# EAGLE design frontend (EAGLE 9.3.1)

## Sheet 1 of 2
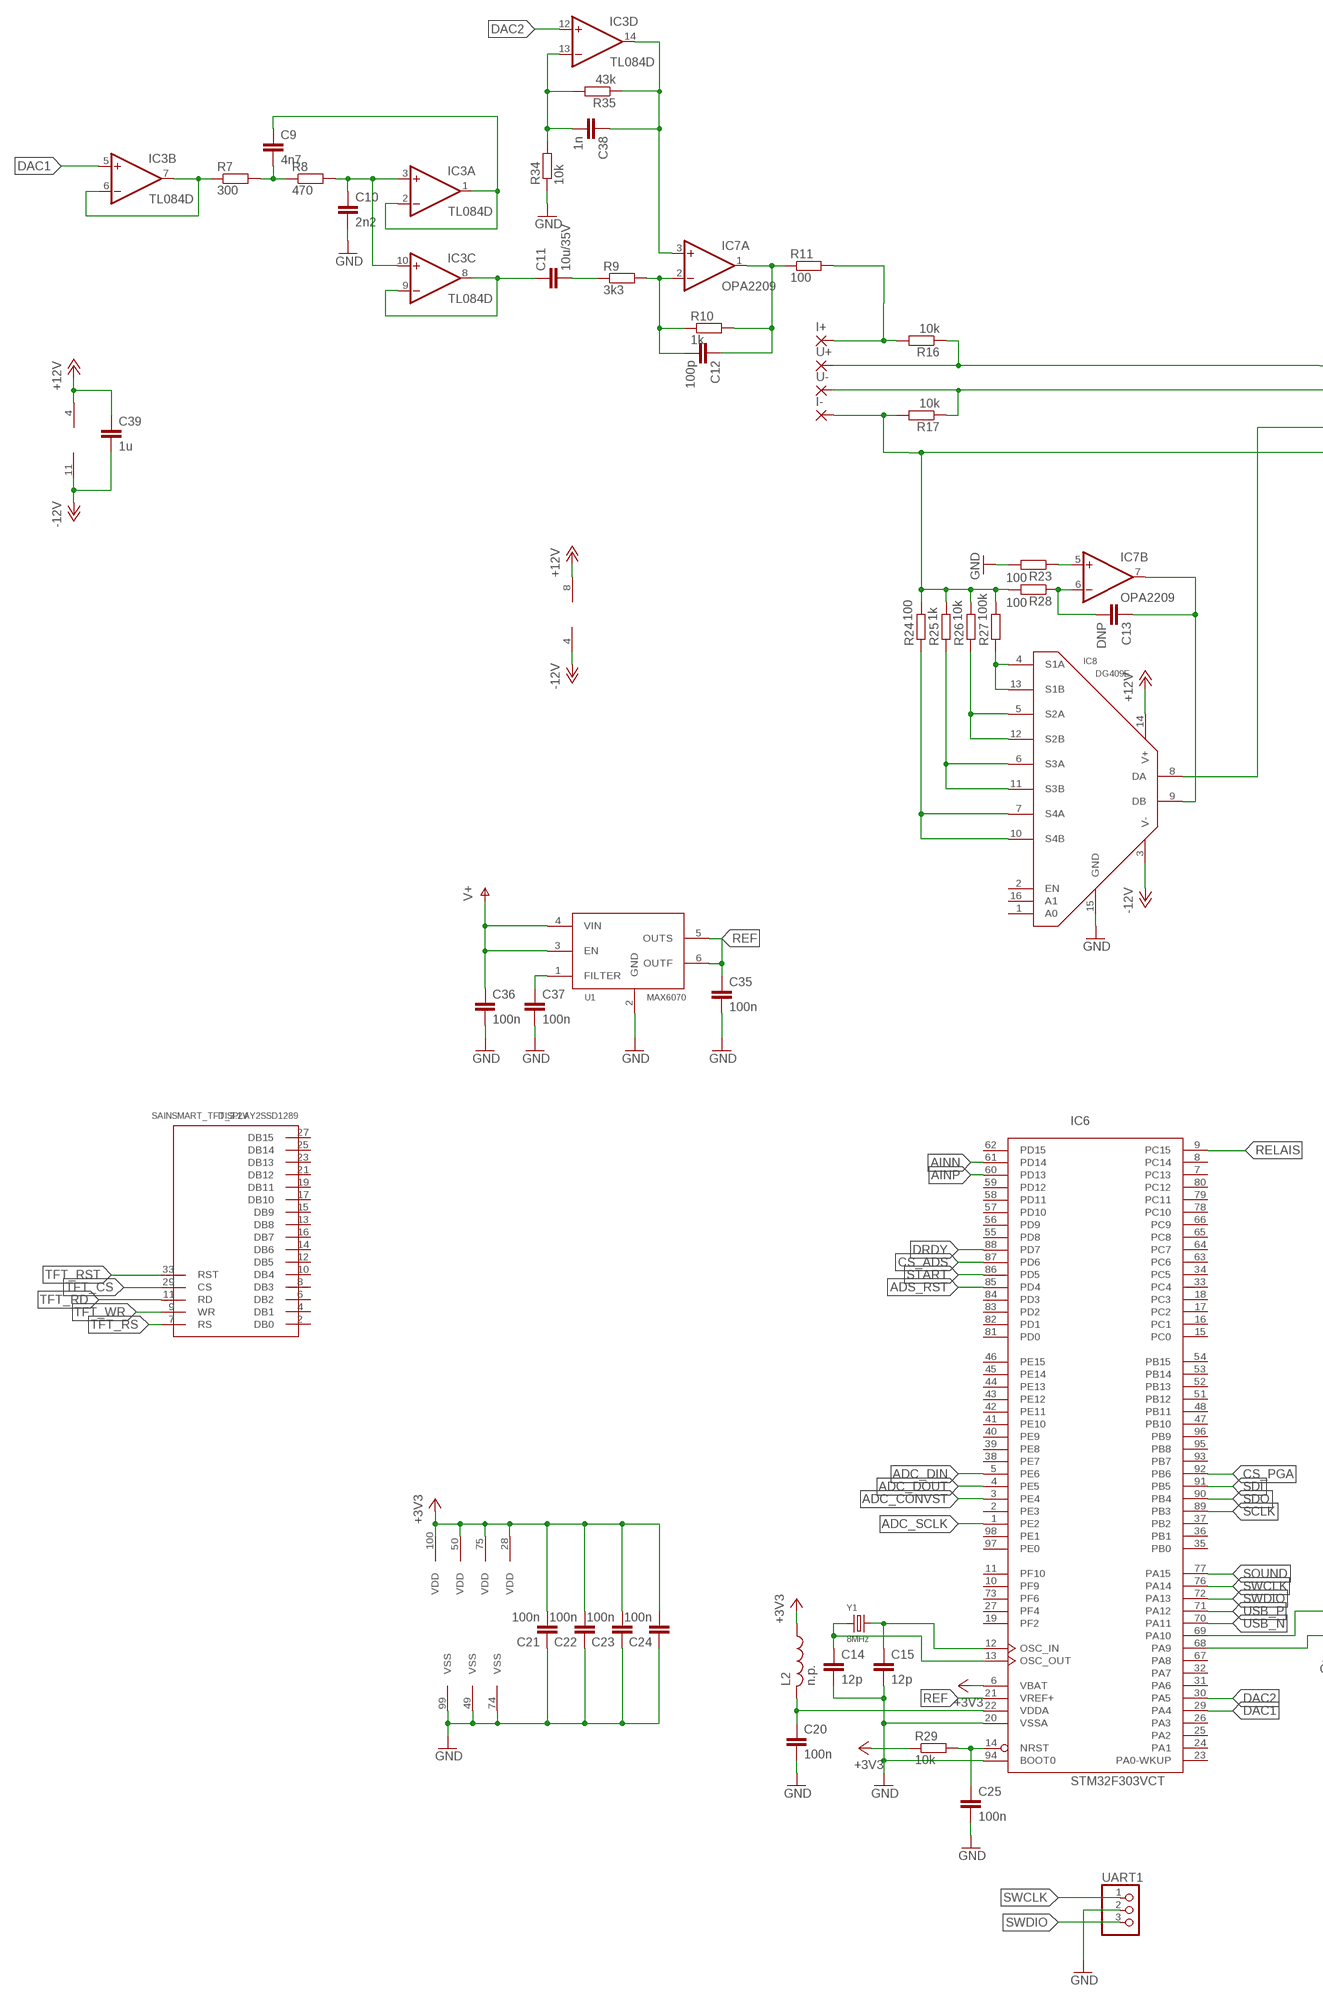
[diagram p0: schematic, sheet 1, part 1 of 2]
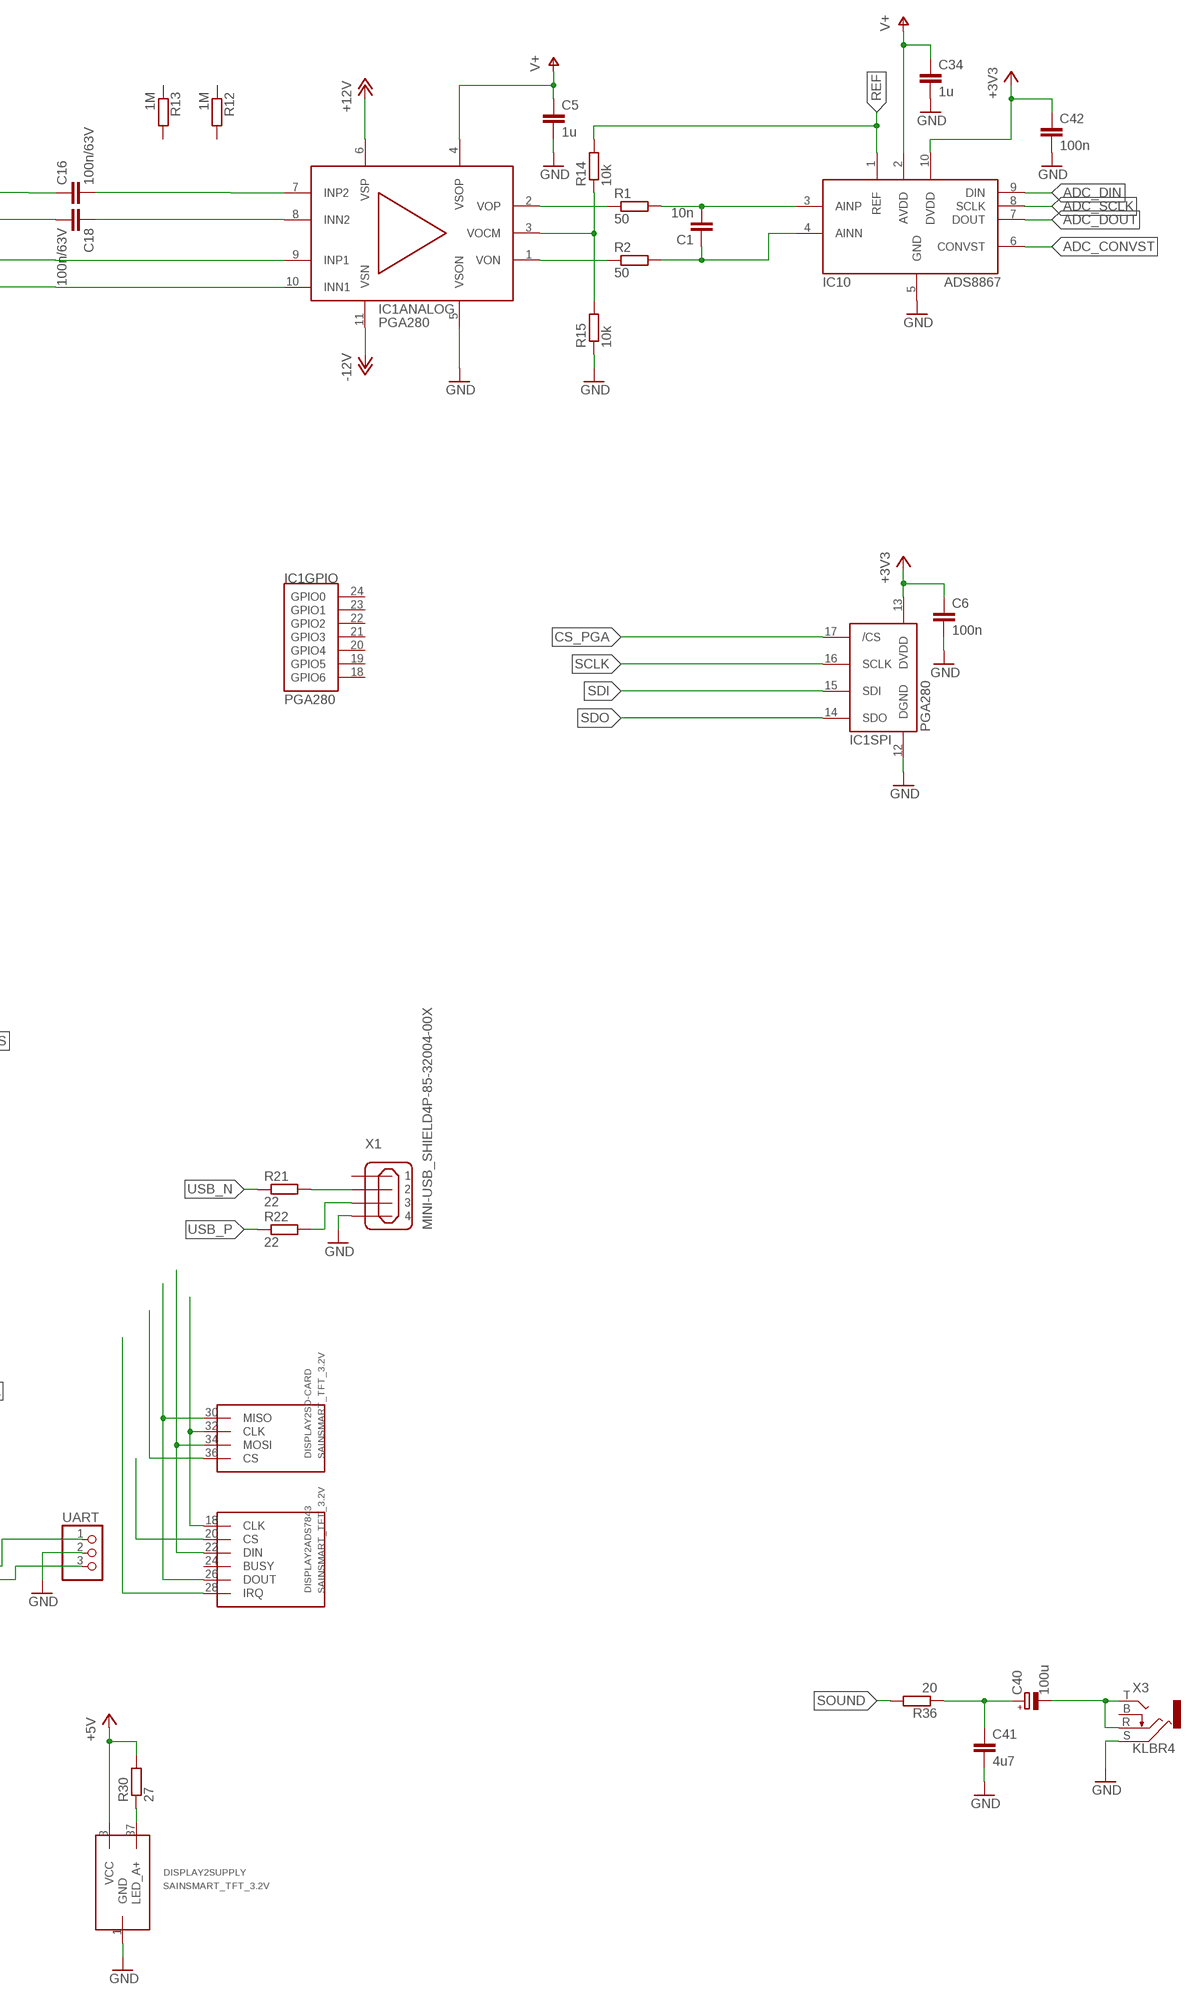
[diagram p1: schematic, sheet 1, part 2 of 2]

### Parts
C1  10n  C-EUC0603K  [C0603K]
C5  1u  C-EUC0603K  [C0603K]
C6  100n  C-EUC0603K  [C0603K]
C9  4n7  C-EUC0603K  [C0603K]
C10  2n2  C-EUC0603K  [C0603K]
C11  10u/35V  C-EUC1206K  [C1206K]
C12  100p  C-EUC0603K  [C0603K]
C13  DNP  C-EUC0603K  [C0603K]
C14  12p  C-EUC0603K  [C0603K]
C15  12p  C-EUC0603K  [C0603K]
C16  100n/63V  C-EUC1206K  [C1206K]
C18  100n/63V  C-EUC1206K  [C1206K]
C20  100n  C-EUC0603K  [C0603K]
C21  100n  C-EUC0603K  [C0603K]
C22  100n  C-EUC0603K  [C0603K]
C23  100n  C-EUC0603K  [C0603K]
C24  100n  C-EUC0603K  [C0603K]
C25  100n  C-EUC0603K  [C0603K]
C34  1u  C-EUC0603K  [C0603K]
C35  100n  C-EUC0603K  [C0603K]
C36  100n  C-EUC0603K  [C0603K]
C37  100n  C-EUC0603K  [C0603K]
C38  1n  C-EUC0603K  [C0603K]
C39  1u  C-EUC0603K  [C0603K]
C40  100u  CPOL-EUE2.5-5  [E2,5-5]
C41  4u7  C-EUC1206K  [C1206K]
C42  100n  C-EUC0603K  [C0603K]
DISPLAY2  SAINSMART_TFT_3.2V  [SAINSMART_ANGLED]
I+  SMD5  [SMD2,54-5,08]
I-  SMD5  [SMD2,54-5,08]
IC1  PGA280  [TSSOP24]
IC3  TL084D  [SO14]
IC6  STM32F303VCT  [LQFP100]
IC7  OPA2209  TL082D  [SO08]
IC8  DG409E  [TSSOP16]
IC10  ADS8867  [SOP50P490X110-10N]
L2  n.p.  INDUCTOR0603  [R0603]
R1  50  R-EU_R0603  [R0603]
R2  50  R-EU_R0603  [R0603]
R7  300  R-EU_R0603  [R0603]
R8  470  R-EU_R0603  [R0603]
R9  3k3  R-EU_R0603  [R0603]
R10  1k  R-EU_R0603  [R0603]
R11  100  R-EU_R0603  [R0603]
R12  1M  R-EU_R0603  [R0603]
R13  1M  R-EU_R0603  [R0603]
R14  10k  R-EU_R0603  [R0603]
R15  10k  R-EU_R0603  [R0603]
R16  10k  R-EU_R0603  [R0603]
R17  10k  R-EU_R0603  [R0603]
R21  22  R-EU_R0603  [R0603]
R22  22  R-EU_R0603  [R0603]
R23  100  R-EU_R0603  [R0603]
R24  100  R-EU_R0603  [R0603]
R25  1k  R-EU_R0603  [R0603]
R26  10k  R-EU_R0603  [R0603]
R27  100k  R-EU_R0603  [R0603]
R28  100  R-EU_R0603  [R0603]
R29  10k  R-EU_R0603  [R0603]
R30  27  R-EU_R1206  [R1206]
R34  10k  R-EU_R0603  [R0603]
R35  43k  R-EU_R0603  [R0603]
R36  20  R-EU_R1206  [R1206]
U1  MAX6070  [SOT23-6L]
U+  SMD5  [SMD2,54-5,08]
U-  SMD5  [SMD2,54-5,08]
UART  PINHD-1X3  [1X03]
UART1  PINHD-1X3  [1X03]
X1  MINI-USB_SHIELD4P-85-32004-00X  [85-32004-00X]
X3  KLBR4  [KLBR4]
Y1  8MHz  CRYSTAL.3.2X2.5MM  [3.2X2.5MM]

### Nets
+3V3: C6.1 C21.2 C22.2 C23.2 C24.2 C42.1 IC1.13(SPI:DVDD) IC6.6(VBAT) IC6.28(VDD) IC6.50(VDD) IC6.75(VDD) IC6.100(VDD) IC10.10(DVDD) L2.1 R29.1 ; also sheet 2
+5V: DISPLAY2.3(SUPPLY:VCC) R30.2 ; also sheet 2
+12V: C39.1 IC1.6(ANALOG:VSP) IC3.4(P:V+) IC7.8(P:V+) IC8.14(V+) ; also sheet 2
-12V: C39.2 IC1.11(ANALOG:VSN) IC3.11(P:V-) IC7.4(P:V-) IC8.3(V-) ; also sheet 2
ADC_CONVST: IC6.3(PE4) IC10.6(CONVST)
ADC_DIN: IC6.5(PE6) IC10.9(DIN)
ADC_DOUT: IC6.4(PE5) IC10.7(DOUT)
ADC_SCLK: IC6.1(PE2) IC10.8(SCLK)
ADS_RST: IC6.85(PD4)
AINN: C1.1 IC6.61(PD14) IC10.4(AINN) R2.2
AINP: C1.2 IC6.60(PD13) IC10.3(AINP) R1.2
CS_ADS: IC6.87(PD6)
CS_PGA: IC1.17(SPI:/CS) IC6.92(PB6)
DAC1: IC3.5(B:+IN) IC6.29(PA4)
DAC2: IC3.12(D:+IN) IC6.30(PA5)
DRDY: IC6.88(PD7)
EXT4: C20.1 IC6.22(VDDA) L2.2
GND: C5.2 C6.2 C10.2 C14.2 C15.2 C20.2 C21.1 C22.1 C23.1 C24.1 C25.2 C34.2 C35.2 C36.2 C37.2 C41.2 C42.2 DISPLAY2.1(SUPPLY:GND) IC1.5(ANALOG:VSON) IC1.12(SPI:DGND) IC6.20(VSSA) IC6.49(VSS) IC6.74(VSS) IC6.94(BOOT0) IC6.99(VSS) IC8.15(GND) IC10.5(GND) R15.1 R23.2 R34.1 U1.2(GND) UART1.2 UART.2 X1.4 X3.S ; also sheet 2
I+: I+.1(P) R11.2 R16.2
I-: I-.1(P) IC1.10(ANALOG:INN1) R17.2 R24.2 R25.2 R26.2 R27.2 R28.2
N$1: IC3.6(B:-IN) IC3.7(B:OUT) R7.1
N$2: C9.2 R7.2 R8.1
N$3: C10.1 IC3.3(A:+IN) IC3.10(C:+IN) R8.2
N$4: C9.1 IC3.1(A:OUT) IC3.2(A:-IN)
N$5: C16.2 IC1.7(ANALOG:INP2)
N$6: C11.1 IC3.8(C:OUT) IC3.9(C:-IN)
N$7: C11.2 R9.1
N$8: C12.2 IC7.2(A:-IN) R9.2 R10.1
N$9: C12.1 IC7.1(A:OUT) R10.2 R11.1
N$10: IC1.3(ANALOG:VOCM) R14.1 R15.2
N$12: C18.1 IC1.8(ANALOG:INN2)
N$14: C38.1 IC3.14(D:OUT) IC7.3(A:+IN) R35.1
N$17: C38.2 IC3.13(D:-IN) R34.2 R35.2
N$18: IC1.9(ANALOG:INP1) IC8.8(DA)
N$21: C13.1 IC7.7(B:OUT) IC8.9(DB)
N$22: C40.+ C41.1 R36.1
N$25: C37.1 U1.1(FILTER)
N$34: C13.2 IC7.6(B:-IN) R28.1
N$36: IC8.4(S1A) IC8.13(S1B) R27.1
N$37: IC8.5(S2A) IC8.12(S2B) R26.1
N$38: IC8.6(S3A) IC8.11(S3B) R25.1
N$39: IC8.7(S4A) IC8.10(S4B) R24.1
N$42: C40.- X3.R X3.T
N$53: C15.1 IC6.12(OSC_IN) Y1.3
N$54: C14.1 IC6.13(OSC_OUT) Y1.1
N$55: R21.2 X1.2
N$56: R22.2 X1.3
N$57: DISPLAY2.22(ADS7843:DIN) DISPLAY2.34(SD-CARD:MOSI)
N$58: DISPLAY2.26(ADS7843:DOUT) DISPLAY2.30(SD-CARD:MISO)
N$59: DISPLAY2.18(ADS7843:CLK) DISPLAY2.32(SD-CARD:CLK)
N$60: C25.1 IC6.14(NRST) R29.2
N$61: DISPLAY2.37(SUPPLY:LED_A+) R30.1
N$66: DISPLAY2.36(SD-CARD:CS)
N$67: DISPLAY2.20(ADS7843:CS)
N$72: DISPLAY2.28(ADS7843:IRQ)
N$81: IC7.5(B:+IN) R23.1
REF: C35.1 IC6.21(VREF+) IC10.1(REF) R14.2 U1.5(OUTS) U1.6(OUTF)
RELAIS: IC6.9(PC15)
RX: IC6.69(PA10) UART.1
SCLK: IC1.16(SPI:SCLK) IC6.89(PB3)
SDI: IC1.15(SPI:SDI) IC6.91(PB5)
SDO: IC1.14(SPI:SDO) IC6.90(PB4)
SOUND: IC6.77(PA15) R36.2
START: IC6.86(PD5)
SWCLK: IC6.76(PA14) UART1.1
SWDIO: IC6.72(PA13) UART1.3
TFT_CS: DISPLAY2.29(SSD1289:CS)
TFT_RD: DISPLAY2.11(SSD1289:RD)
TFT_RS: DISPLAY2.7(SSD1289:RS)
TFT_RST: DISPLAY2.33(SSD1289:RST)
TFT_WR: DISPLAY2.9(SSD1289:WR)
TX: IC6.68(PA9) UART.3
U+: C16.1 R16.1 U+.1(P)
U-: C18.2 R17.1 U-.1(P)
USB_N: IC6.70(PA11) R21.1
USB_P: IC6.71(PA12) R22.1
V+: C5.1 C34.1 C36.1 IC1.4(ANALOG:VSOP) IC10.2(AVDD) U1.3(EN) U1.4(VIN) ; also sheet 2
VON: IC1.1(ANALOG:VON) R2.1
VOP: IC1.2(ANALOG:VOP) R1.1
Unconnected: DISPLAY2.2(SSD1289:DB0) DISPLAY2.4(SSD1289:DB1) DISPLAY2.6(SSD1289:DB2) DISPLAY2.8(SSD1289:DB3) DISPLAY2.10(SSD1289:DB4) DISPLAY2.12(SSD1289:DB5) DISPLAY2.13(SSD1289:DB8) DISPLAY2.14(SSD1289:DB6) DISPLAY2.15(SSD1289:DB9) DISPLAY2.16(SSD1289:DB7) DISPLAY2.17(SSD1289:DB10) DISPLAY2.19(SSD1289:DB11) DISPLAY2.21(SSD1289:DB12) DISPLAY2.23(SSD1289:DB13) DISPLAY2.24(ADS7843:BUSY) DISPLAY2.25(SSD1289:DB14) DISPLAY2.27(SSD1289:DB15) IC1.18(GPIO:GPIO6) IC1.19(GPIO:GPIO5) IC1.20(GPIO:GPIO4) IC1.21(GPIO:GPIO3) IC1.22(GPIO:GPIO2) IC1.23(GPIO:GPIO1) IC1.24(GPIO:GPIO0) IC6.2(PE3) IC6.7(PC13) IC6.8(PC14) IC6.10(PF9) IC6.11(PF10) IC6.15(PC0) IC6.16(PC1) IC6.17(PC2) IC6.18(PC3) IC6.19(PF2) IC6.23(PA0-WKUP) IC6.24(PA1) IC6.25(PA2) IC6.26(PA3) IC6.27(PF4) IC6.31(PA6) IC6.32(PA7) IC6.33(PC4) IC6.34(PC5) IC6.35(PB0) IC6.36(PB1) IC6.37(PB2) IC6.38(PE7) IC6.39(PE8) IC6.40(PE9) IC6.41(PE10) IC6.42(PE11) IC6.43(PE12) IC6.44(PE13) IC6.45(PE14) IC6.46(PE15) IC6.47(PB10) IC6.48(PB11) IC6.51(PB12) IC6.52(PB13) IC6.53(PB14) IC6.54(PB15) IC6.55(PD8) IC6.56(PD9) IC6.57(PD10) IC6.58(PD11) IC6.59(PD12) IC6.62(PD15) IC6.63(PC6) IC6.64(PC7) IC6.65(PC8) IC6.66(PC9) IC6.67(PA8) IC6.73(PF6) IC6.78(PC10) IC6.79(PC11) IC6.80(PC12) IC6.81(PD0) IC6.82(PD1) IC6.83(PD2) IC6.84(PD3) IC6.93(PB7) IC6.95(PB8) IC6.96(PB9) IC6.97(PE0) IC6.98(PE1) IC8.1(A0) IC8.2(EN) IC8.16(A1) R12.1 R12.2 R13.1 R13.2 X1.1 X1.M1(S1) X1.M2(S2) X3.B

## Sheet 2 of 2
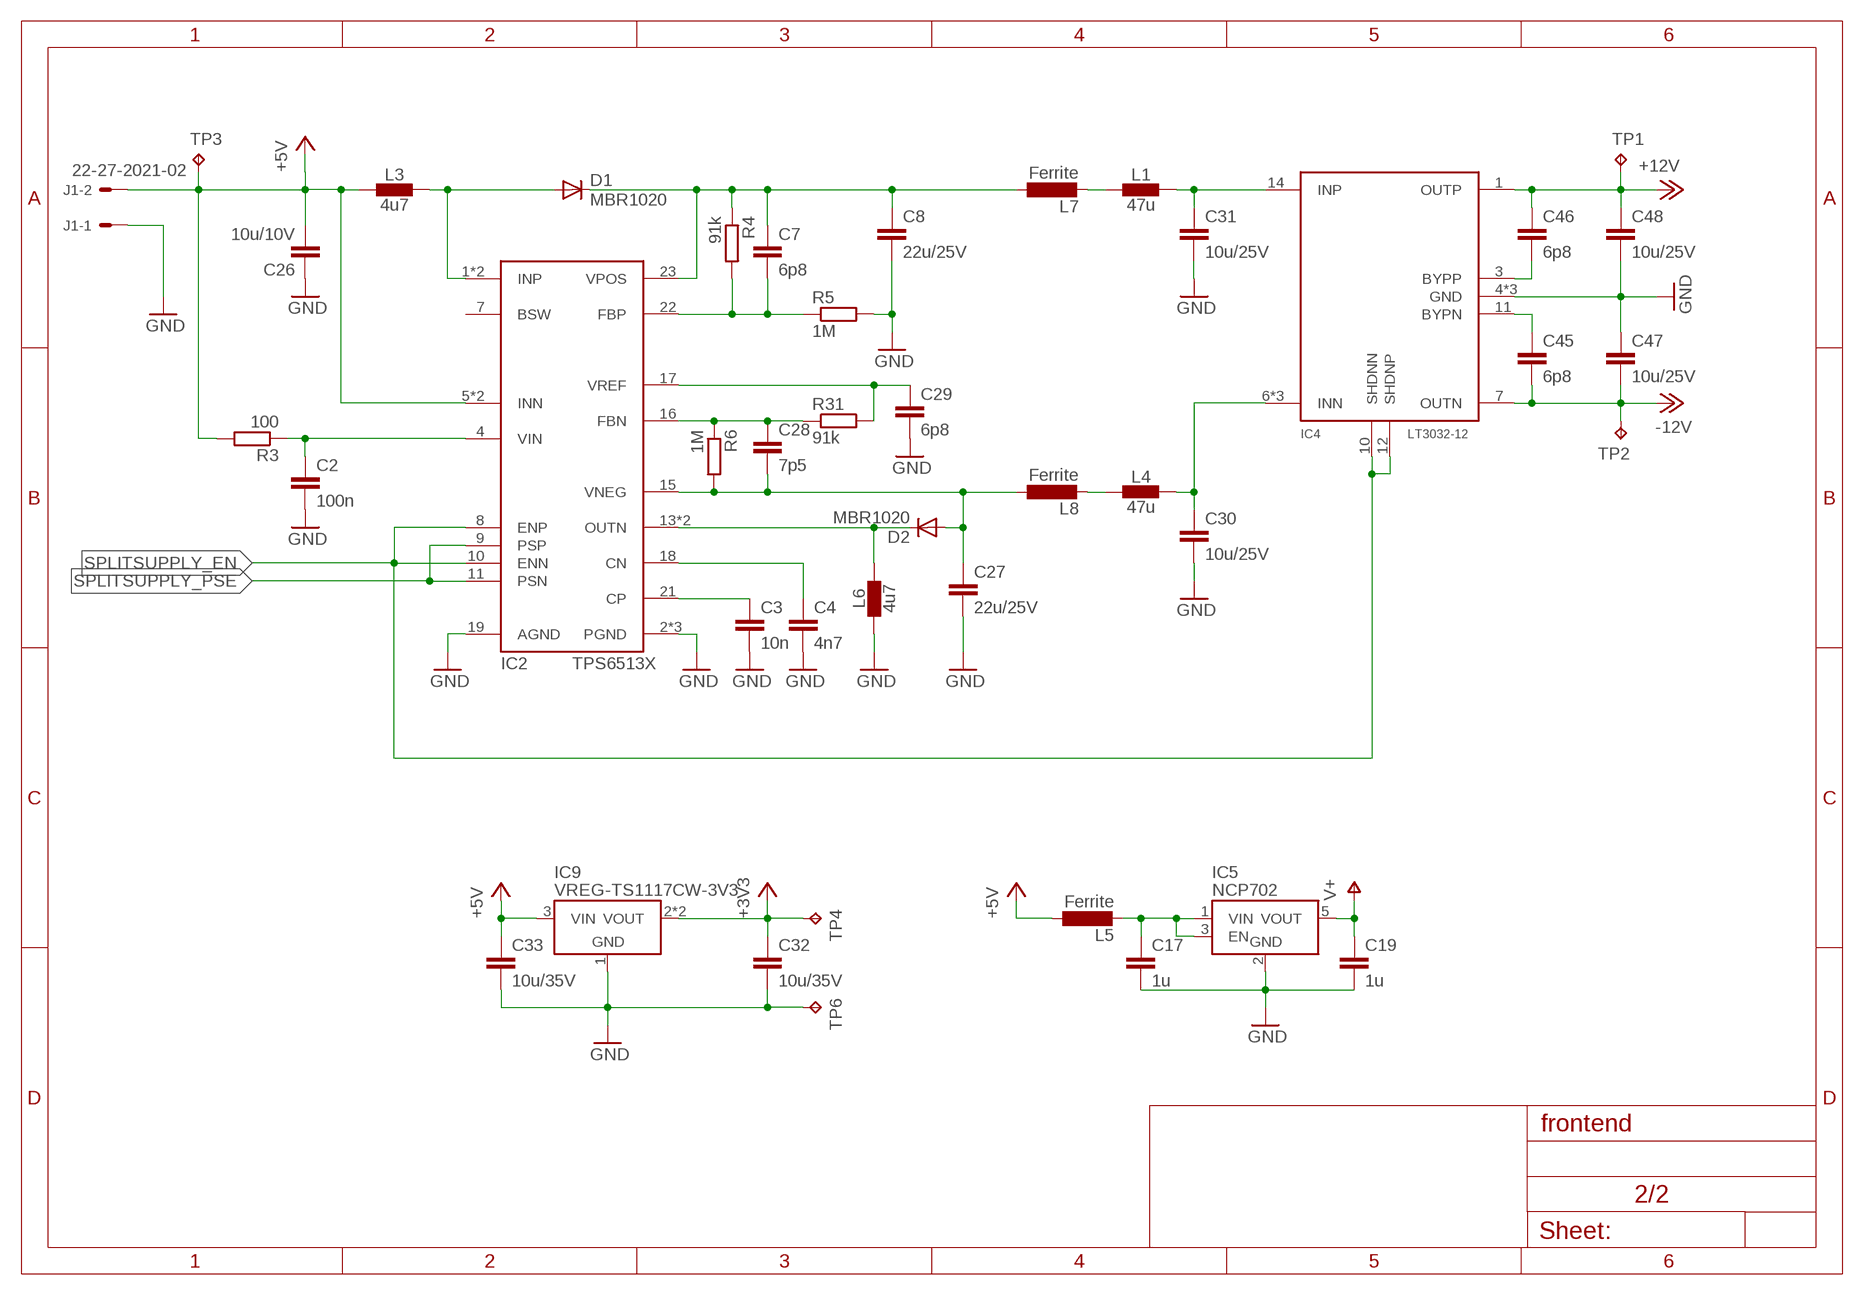
[diagram p2: schematic, sheet 2]

### Parts
C2  100n  C-EUC0603K  [C0603K]
C3  10n  C-EUC0603K  [C0603K]
C4  4n7  C-EUC0603K  [C0603K]
C7  6p8  C-EUC0603K  [C0603K]
C8  22u/25V  C-EUC1206K  [C1206K]
C17  1u  C-EUC0603  [C0603]
C19  1u  C-EUC0603  [C0603]
C26  10u/10V  C-EUC1206K  [C1206K]
C27  22u/25V  C-EUC1206K  [C1206K]
C28  7p5  C-EUC0603K  [C0603K]
C29  6p8  C-EUC0603K  [C0603K]
C30  10u/25V  C-EUC1206K  [C1206K]
C31  10u/25V  C-EUC1206K  [C1206K]
C32  10u/35V  C-EUC1206K  [C1206K]
C33  10u/35V  C-EUC1206K  [C1206K]
C45  6p8  C-EUC0603K  [C0603K]
C46  6p8  C-EUC0603K  [C0603K]
C47  10u/25V  C-EUC1206K  [C1206K]
C48  10u/25V  C-EUC1206K  [C1206K]
D1  MBR1020  DIODE-SOD123  [SOD123]
D2  MBR1020  DIODE-SOD123  [SOD123]
IC2  TPS6513X  [QFN50P400X400X100-25T250N]
IC4  LT3032-12  LT3032  [SON50P300X400X80-14N]
IC5  NCP702  [SOT95P240X110-5]
IC9  VREG-TS1117CW-3V3  [SOT223]
J1  22-27-2021-02  [6410-02]
L1  47u  INDUCTOR-1212  [L_1212]
L3  4u7  INDUCTOR-1212  [L_1212]
L4  47u  INDUCTOR-1212  [L_1212]
L5  Ferrite  INDUCTOR0603  [R0603]
L6  4u7  INDUCTOR-1212  [L_1212]
L7  Ferrite  INDUCTOR0603  [R0603]
L8  Ferrite  INDUCTOR0603  [R0603]
R3  100  R-EU_R0603  [R0603]
R4  91k  R-EU_R0603  [R0603]
R5  1M  R-EU_R0603  [R0603]
R6  1M  R-EU_R0603  [R0603]
R31  91k  R-EU_R0603  [R0603]
TP1  TPB2,54  [B2,54]
TP2  TPB2,54  [B2,54]
TP3  TPB2,54  [B2,54]
TP4  TPB2,54  [B2,54]
TP6  TPB2,54  [B2,54]

### Nets
+3V3: C32.1 IC9.2(VOUT) IC9.4(VOUT) TP4.TP ; also sheet 1
+5V: C26.2 C33.1 IC2.5(INN) IC2.6(INN) IC9.3(VIN) J1.2 L3.1 L5.1 R3.2 TP3.TP ; also sheet 1
+12V: C46.1 C48.1 IC4.1(OUTP) TP1.TP ; also sheet 1
-12V: C45.2 C47.2 IC4.7(OUTN) TP2.TP ; also sheet 1
GND: C2.2 C3.2 C4.2 C8.2 C17.2 C19.2 C26.1 C27.2 C29.2 C30.2 C31.2 C32.2 C33.2 C47.1 C48.2 IC2.2(PGND) IC2.3(PGND) IC2.19(AGND) IC2.25(PGND) IC4.4(GND) IC4.5(GND) IC4.EP4(GND) IC5.2(GND) IC9.1(GND) J1.1 L6.1 R5.2 TP6.TP ; also sheet 1
N$11: C17.1 IC5.1(VIN) IC5.3(EN) L5.2
N$20: C2.1 IC2.4(VIN) R3.1
N$63: D1.A IC2.1(INP) IC2.24(INP) L3.2
N$64: C7.1 C8.1 D1.C IC2.23(VPOS) L7.1 R4.1
N$65: D2.C IC2.13(OUTN) IC2.14(OUTN) L6.2
N$68: C3.1 IC2.21(CP)
N$69: C4.1 IC2.18(CN)
N$70: C7.2 IC2.22(FBP) R4.2 R5.1
N$71: C27.1 C28.2 D2.A IC2.15(VNEG) L8.1 R6.2
N$73: L4.1 L8.2
N$74: C30.1 IC4.6(INN) IC4.9(INN) IC4.EP9(INN) L4.2
N$75: C29.1 IC2.17(VREF) R31.2
N$76: C28.1 IC2.16(FBN) R6.1 R31.1
N$77: L1.1 L7.2
N$78: C31.1 IC4.14(INP) L1.2
N$79: C46.2 IC4.3(BYPP)
N$80: C45.1 IC4.11(BYPN)
SPLITSUPPLY_EN: IC2.8(ENP) IC2.10(ENN) IC4.10(SHDNN) IC4.12(SHDNP)
SPLITSUPPLY_PSE: IC2.9(PSP) IC2.11(PSN)
V+: C19.1 IC5.5(VOUT) ; also sheet 1
Unconnected: IC2.7(BSW)

## Library data of the parts
C1-C39 C41 C42 C45-C48 = rcl:C-EU: CAPACITOR, European symbol
C40 = rcl:CPOL-EU: POLARIZED CAPACITOR, European symbol
D1 D2 = diode:DIODE-: DIODE
DISPLAY2 = sainsmart:SAINSMART_TFT_3.2
I+ I- U+ U- = wirepad:SMD5: SMD PAD
IC1 = ti-analog:PGA280
IC2 = custom-ic:TPS6513X
IC3 = linear:TL084: OP AMP
IC4 = custom-ic:LT3032
IC5 = rf:NCP702
IC6 = micro-stm_v3:STM32F303V*T: ARM 32-bit Cortex™-M3 CPU 72 MHz maximum frequency 128 to 256 Kbytes of Flash memory 32 to 40 kbytes of SRAM 87 GPIOs 2.0 to 3.6 V application supply
IC7 = linear:TL082: OP AMP Data sheet; DATA_SHEET: <a href="http://www.ti.com/lit/ds/symlink/tl084a.pdf"> Data sheet </a>
IC8 = vishay-analog:DG409
IC9 = we-power-mod:VREG: Voltage Regulators (LDOs, Switching Converters...) LDOs Taiwan Semi TS1117 800mA max 15V - compatible On Semi NCP1117 1A max 20V - compatible Diodes AP2111H 0.6A max 6V (0.25V@0.6A) - compatible Diodes AP2114H 1A max 6V (0.45V@1A) Taiwan Semi TS9011 250mA max 12V - compatible Diodes AP2210 300mA max 15V - compatible Microchip MCP1700 250mA max 6.5V - compatible Microchip MCP1702 250mA max 13V - compatible Microchip MCP1703 250mA max 16V - compatible Microchip MCP1754 150mA max 16V Taiwan Semi TS5204 150mA max 16V (low noise) DC/DC Converter Modules Recom R-78Ex.x-1.0-W36 1A max 28V - compatible CUI V78xx-2000 2A max 18V Murata OKI-78SR-x.x/1.5-W36 1.5A max 36V
IC10 = custom-ic:ADS8867
J1 = con-molex:22-?-02: CONNECTOR wire to board 2.54 mm (.1 inch) pitch header; OC_FARNELL: unknown; OC_NEWARK: unknown
L1 L3 L4 L6 = we-power:INDUCTOR: Power Inductors Taiyo Yuden NR6028 NR6028T0R9N - 0.9uH, Ir=6.6A NR6028T1R5N - 1.5uH, Ir=5.0A NR6028T2R2N - 2.2uH, Ir=4.2A NR6028T3R0N - 3.0uH, Ir=3.6A NR6028T4R7M - 4.7uH, Ir=2.7A NR6028T6R0M - 6.0uH, Ir=2.5A NR6028T100M - 10uH, Ir=1.9A NR6028T150M - 15uH, Ir=1.6A NR6028T220M - 22uH, Ir=1.3A NR6028T330M - 33uH, Ir=1.1A NR6028T470M - 47uH, Ir=0.95A NR6028T680M - 68uH, Ir=0.76A NR6028T101M - 100uH, Ir=0.62A Taiyo Yuden NR6045 NR6045T1R0N - 1.0uH, Ir=8.5A NR6045T1R3N - 1.3uH, Ir=8.0A NR6045T1R8N - 1.8uH, Ir=7.0A NR6045T2R3N - 2.3uH, Ir=6.0A NR6045T3R0N - 3.0uH, Ir=5.0A NR6045T4R5M - 4.5uH, Ir=4.0A NR6045T6R3M - 6.3uH, Ir=3.8A NR6045T100M - 10uH, Ir=3.0A NR6045T150M - 15uH, Ir=2.3A NR6045T220M - 22uH, Ir=1.9A NR6045T330M - 33uH, Ir=1.5A NR6045T470M - 47uH, Ir=1.3A NR6045T680M - 68uH, Ir=1.0A NR6045T101M - 100uH, Ir=0.8A
L2 = xmaker:INDUCTOR: Inductor
L5 L7 L8 = rf:INDUCTOR
R1 R2 R14-R17 R21 R22 R29 R30 = resistor:R-EU_: RESISTOR, European symbol
R3-R13 R23-R28 R31 R34-R36 = rcl:R-EU_: RESISTOR, European symbol
TP1-TP4 TP6 = testpad:TP: Test pad
U1 = maxim:MAX6070
UART UART1 = pinhead:PINHD-1X3: PIN HEADER
X1 = con-cypressindustries:MINI-USB_SHIELD4P-: MINI USB 4 Pol. Source: www.cypressindustries.com; OC_FARNELL: unknown; OC_NEWARK: unknown
X3 = con-lumberg:KLBR4: Jack connectors according to JISC 6560, 3.5 mm Klinkeneinbaukupplung nach JISC 6560, 3,5 mm, 3-polig/ stereo, abgewinkelte Ausführung, mit Öffner, für Leiterplatten Source: Data sheet; MPN: KLBR 4; OC_FARNELL: 1217016; OC_NEWARK: 97K2709
Y1 = abracon:CRYSTAL

## Board
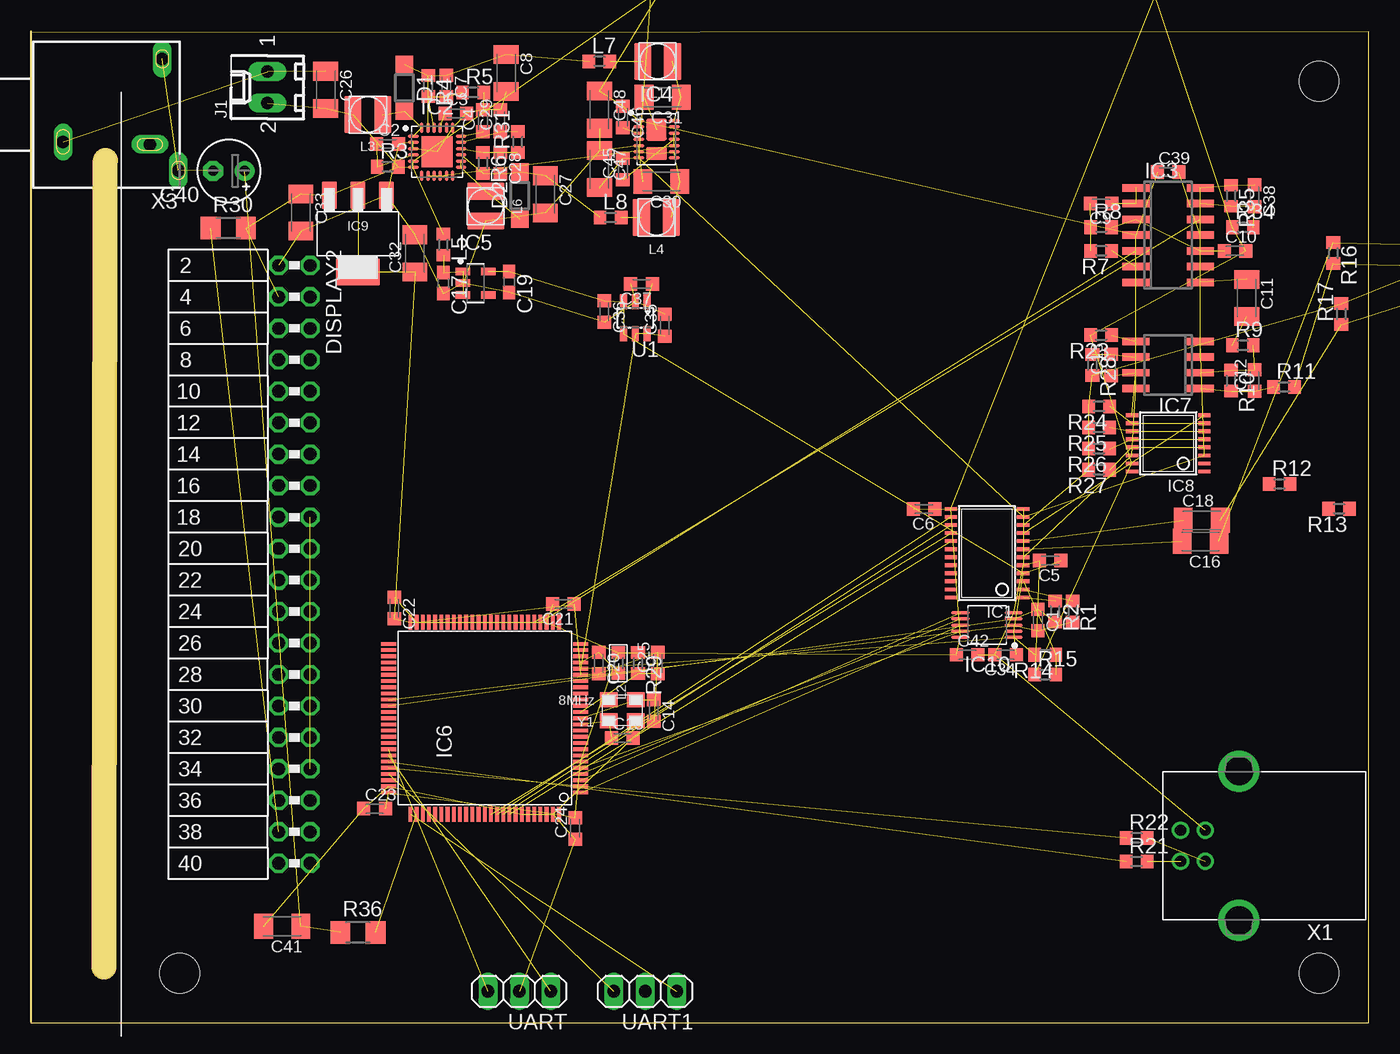
[diagram p3: board, top side]
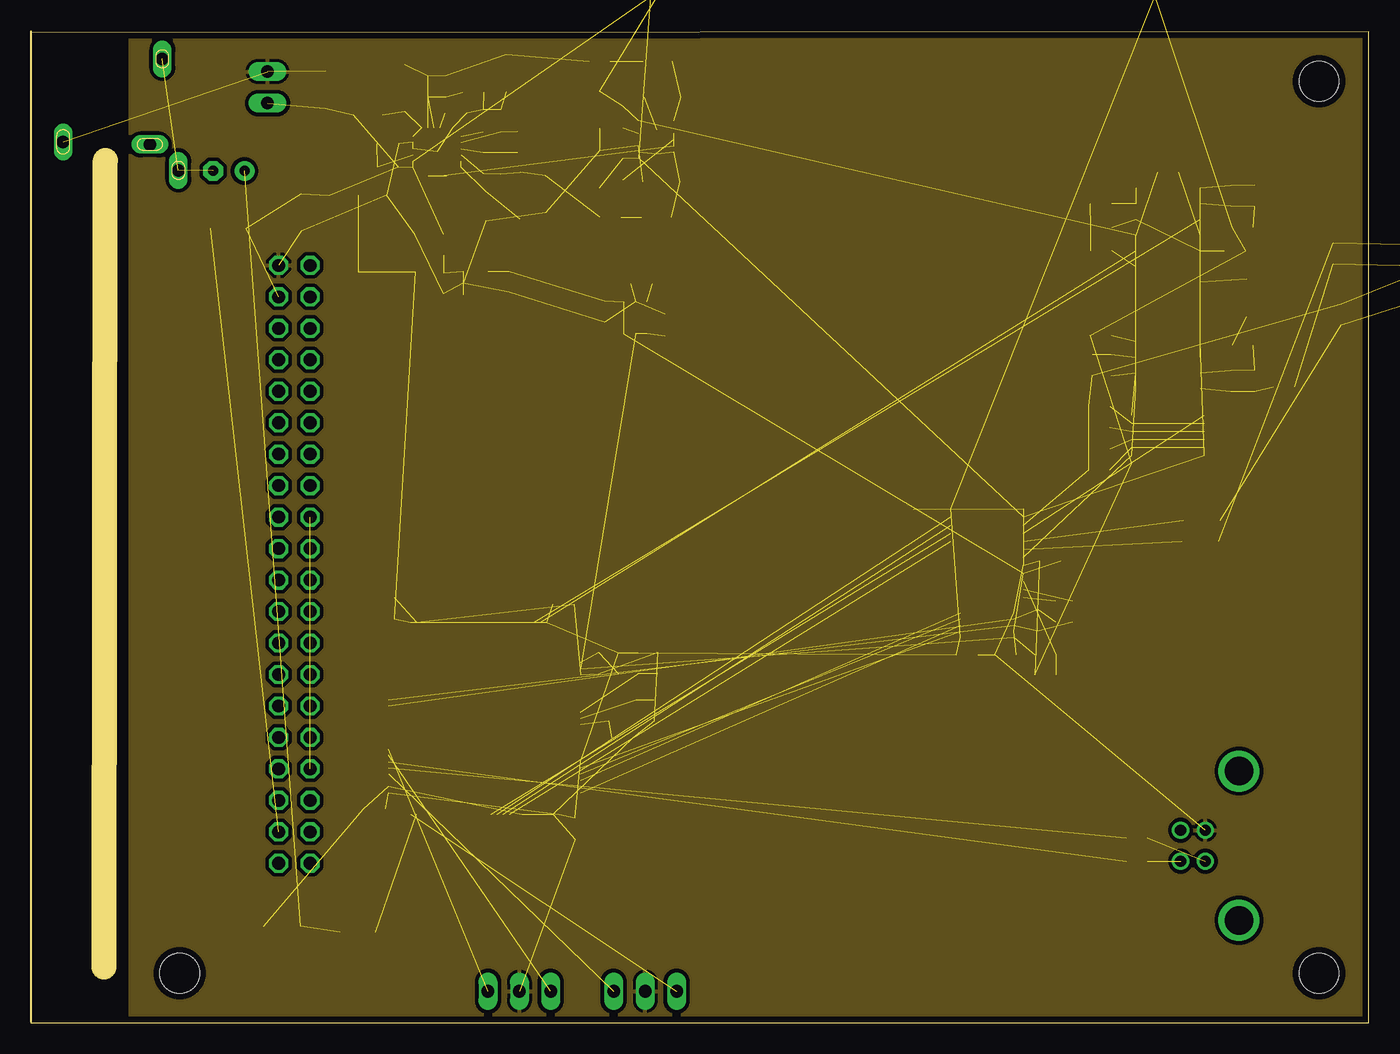
[diagram p4: board, inner layer Route2]
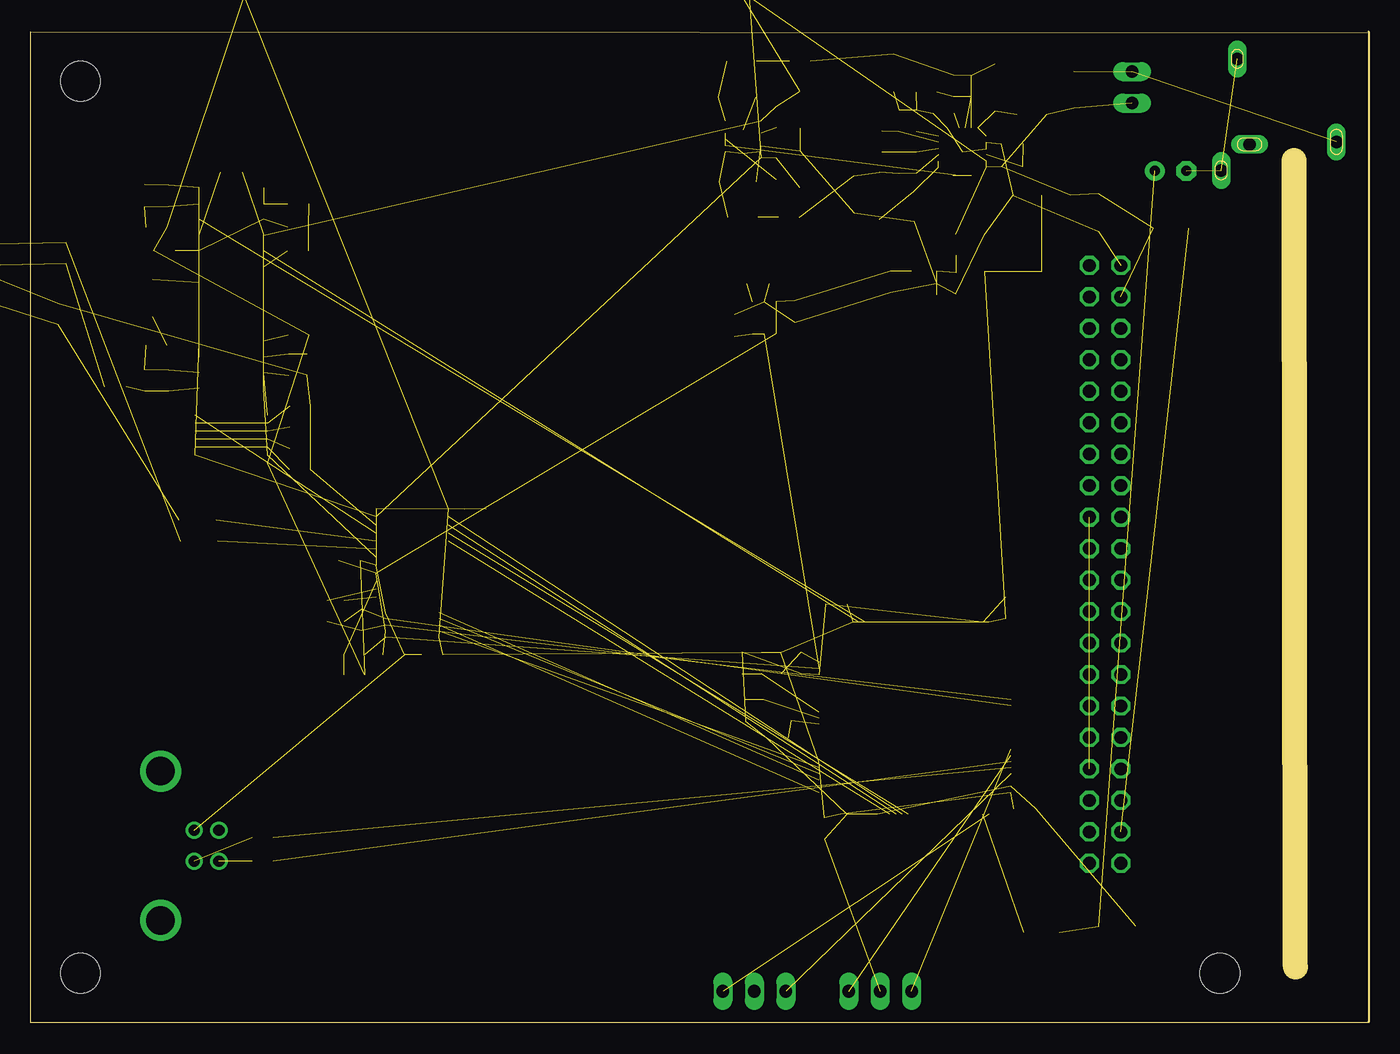
[diagram p5: board, bottom side, seen from below]

Size 108 x 80 mm. Coordinates in mm from the lower left corner, seen from the top.
Outline: 0,80 0,0.1
Outline: 0,0 108,0 108,80 0,79.9 0,0
Copper layers (1+2*15+16): Top 0.035mm / dielectric 0.2mm / Route2 0.035mm / dielectric 1.2mm / Route15 0.035mm / dielectric 0.2mm / Bottom 0.035mm
Design rules "Elecrow_2-layer_PCB_eagle_rule *": minimum track width 6mil, minimum drill 12mil, track to track 6mil, track to pad 6mil, pad to pad 6mil, via to via 8mil, smd to smd 0mil, copper to edge 20mil, drill to drill 10mil, minimum pad ring 6mil, minimum via ring 6mil, stop-mask expansion 0mil, vias tented up to drill 100mil, thermal gap 10mil
Holes 3.2 mm at 104,4 104,76 12,4
tKeepout: area 101,73 to 107,79; area 101,1 to 107,7; area 9,1 to 15,7
Milling: 1 lines

### Footprints (pad centres in the part's own frame; a part is rotated, then mirrored left to right if it is on the bottom)
C0603K = smd 1.05 x 1.08: 1 -0.875,0; 2 0.875,0
C1206K = smd 1.5 x 2: 1 -1.5,0; 2 1.5,0
C0603 = smd 1.1 x 1: 1 -0.85,0; 2 0.85,0
E2,5-5 = drill 0.813 pad 1.6: + -1.27,0 | drill 0.813 pad 1.6 octagon: - 1.27,0
SOD123 = smd 1.4 x 1.4: A 1.9,0; C -1.9,0
SAINSMART_ANGLED = drill 1.016 octagon: 1 -24.13,0; 2 -24.13,2.54; 3 -21.59,0; 4 -21.59,2.54; 5 -19.05,0; 6 -19.05,2.54; 7 -16.51,0; 8 -16.51,2.54; 9 -13.97,0; 10 -13.97,2.54; 11 -11.43,0; 12 -11.43,2.54; 13 -8.89,0; 14 -8.89,2.54; 15 -6.35,0; 16 -6.35,2.54; 17 -3.81,0; 18 -3.81,2.54; 19 -1.27,0; 20 -1.27,2.54; 21 1.27,0; 22 1.27,2.54; 23 3.81,0; 24 3.81,2.54; 25 6.35,0; 26 6.35,2.54; 27 8.89,0; 28 8.89,2.54; 29 11.43,0; 30 11.43,2.54; 31 13.97,0; 32 13.97,2.54; 33 16.51,0; 34 16.51,2.54; 35 19.05,0; 36 19.05,2.54; 37 21.59,0; 38 21.59,2.54; 39 24.13,0; 40 24.13,2.54
SMD2,54-5,08 = smd 2.54 x 5.08: 1 0,0
TSSOP24 = smd 0.305 x 0.991: 1 -3.575,-2.918; 2 -2.925,-2.918; 3 -2.275,-2.918; 4 -1.625,-2.918; 5 -0.975,-2.918; 6 -0.325,-2.918; 7 0.325,-2.918; 8 0.975,-2.918; 9 1.625,-2.918; 10 2.275,-2.918; 11 2.925,-2.918; 12 3.575,-2.918; 13 3.575,2.918; 14 2.925,2.918; 15 2.275,2.918; 16 1.625,2.918; 17 0.975,2.918; 18 0.325,2.918; 19 -0.325,2.918; 20 -0.975,2.918; 21 -1.625,2.918; 22 -2.275,2.918; 23 -2.925,2.918; 24 -3.575,2.918
QFN50P400X400X100-25T250N = smd 0.86 x 0.27: 1 -1.935,1.25; 2 -1.935,0.75; 3 -1.935,0.25; 4 -1.935,-0.25; 5 -1.935,-0.75; 6 -1.935,-1.25; 13 1.935,-1.25; 14 1.935,-0.75; 15 1.935,-0.25; 16 1.935,0.25; 17 1.935,0.75; 18 1.935,1.25 | smd 0.27 x 0.86: 7 -1.25,-1.935; 8 -0.75,-1.935; 9 -0.25,-1.935; 10 0.25,-1.935; 11 0.75,-1.935; 12 1.25,-1.935; 19 1.25,1.935; 20 0.75,1.935; 21 0.25,1.935; 22 -0.25,1.935; 23 -0.75,1.935; 24 -1.25,1.935 | smd 2.5 x 2.5: 25 0,0
SO14 = smd 0.6 x 2.2: 1 -3.81,-2.6; 2 -2.54,-2.6; 3 -1.27,-2.6; 4 0,-2.6; 5 1.27,-2.6; 6 2.54,-2.6; 7 3.81,-2.6; 8 3.81,2.6; 9 2.54,2.6; 10 1.27,2.6; 11 0,2.6; 12 -1.27,2.6; 13 -2.54,2.6; 14 -3.81,2.6
SON50P300X400X80-14N = smd 0.86 x 0.27: 1 -1.435,1.5; 2 -1.435,1; 3 -1.435,0.5; 4 -1.435,0; 5 -1.435,-0.5; 6 -1.435,-1; 7 -1.435,-1.5; 8 1.435,-1.5; 9 1.435,-1; 10 1.435,-0.5; 11 1.435,0; 12 1.435,0.5; 13 1.435,1; 14 1.435,1.5 | smd 1.65 x 1.78: EP4 0,0.79 | smd 1.65 x 1.07: EP9 0,-1.145
SOT95P240X110-5 = smd 1.18 x 0.609: 1 -1.024,0.95; 2 -1.024,0; 3 -1.024,-0.95; 4 1.024,-0.95; 5 1.024,0.95
LQFP100 = smd 0.3 x 1.2: 1 -6,-7.75; 2 -5.5,-7.75; 3 -5,-7.75; 4 -4.5,-7.75; 5 -4,-7.75; 6 -3.5,-7.75; 7 -3,-7.75; 8 -2.5,-7.75; 9 -2,-7.75; 10 -1.5,-7.75; 11 -1,-7.75; 12 -0.5,-7.75; 13 0,-7.75; 14 0.5,-7.75; 15 1,-7.75; 16 1.5,-7.75; 17 2,-7.75; 18 2.5,-7.75; 19 3,-7.75; 20 3.5,-7.75; 21 4,-7.75; 22 4.5,-7.75; 23 5,-7.75; 24 5.5,-7.75; 25 6,-7.75; 51 6,7.75; 52 5.5,7.75; 53 5,7.75; 54 4.5,7.75; 55 4,7.75; 56 3.5,7.75; 57 3,7.75; 58 2.5,7.75; 59 2,7.75; 60 1.5,7.75; 61 1,7.75; 62 0.5,7.75; 63 0,7.75; 64 -0.5,7.75; 65 -1,7.75; 66 -1.5,7.75; 67 -2,7.75; 68 -2.5,7.75; 69 -3,7.75; 70 -3.5,7.75; 71 -4,7.75; 72 -4.5,7.75; 73 -5,7.75; 74 -5.5,7.75; 75 -6,7.75 | smd 1.2 x 0.3: 26 7.75,-6; 27 7.75,-5.5; 28 7.75,-5; 29 7.75,-4.5; 30 7.75,-4; 31 7.75,-3.5; 32 7.75,-3; 33 7.75,-2.5; 34 7.75,-2; 35 7.75,-1.5; 36 7.75,-1; 37 7.75,-0.5; 38 7.75,0; 39 7.75,0.5; 40 7.75,1; 41 7.75,1.5; 42 7.75,2; 43 7.75,2.5; 44 7.75,3; 45 7.75,3.5; 46 7.75,4; 47 7.75,4.5; 48 7.75,5; 49 7.75,5.5; 50 7.75,6; 76 -7.75,6; 77 -7.75,5.5; 78 -7.75,5; 79 -7.75,4.5; 80 -7.75,4; 81 -7.75,3.5; 82 -7.75,3; 83 -7.75,2.5; 84 -7.75,2; 85 -7.75,1.5; 86 -7.75,1; 87 -7.75,0.5; 88 -7.75,0; 89 -7.75,-0.5; 90 -7.75,-1; 91 -7.75,-1.5; 92 -7.75,-2; 93 -7.75,-2.5; 94 -7.75,-3; 95 -7.75,-3.5; 96 -7.75,-4; 97 -7.75,-4.5; 98 -7.75,-5; 99 -7.75,-5.5; 100 -7.75,-6
SO08 = smd 0.6 x 2.2: 1 -1.905,-2.6; 2 -0.635,-2.6; 3 0.635,-2.6; 4 1.905,-2.6; 5 1.905,2.6; 6 0.635,2.6; 7 -0.635,2.6; 8 -1.905,2.6
TSSOP16 = smd 0.305 x 0.991: 1 -2.275,-2.918; 2 -1.625,-2.918; 3 -0.975,-2.918; 4 -0.325,-2.918; 5 0.325,-2.918; 6 0.975,-2.918; 7 1.625,-2.918; 8 2.275,-2.918; 9 2.275,2.918; 10 1.625,2.918; 11 0.975,2.918; 12 0.325,2.918; 13 -0.325,2.918; 14 -0.975,2.918; 15 -1.625,2.918; 16 -2.275,2.918
SOT223 = smd 2.235 x 1.219: 1 -3.099,2.311; 2 -3.099,0; 3 -3.099,-2.311 | smd 2.2 x 3.6: 4 3.099,0
SOP50P490X110-10N = smd 1.471 x 0.28: 1 -2.15,1; 2 -2.15,0.5; 3 -2.15,0; 4 -2.15,-0.5; 5 -2.15,-1; 6 2.15,-1; 7 2.15,-0.5; 8 2.15,0; 9 2.15,0.5; 10 2.15,1
6410-02 = drill 1.016 long: 1 1.27,0; 2 -1.27,0
L_1212 = smd 3 x 1.4: 1 0,1.2; 2 0,-1.2
R0603 = smd 1.1 x 1: 1 0,-0.85; 2 0,0.85
R0603' = smd 1 x 1.1: 1 -0.85,0; 2 0.85,0
R1206 = smd 1.6 x 1.803: 1 -1.422,0; 2 1.422,0
B2,54 = smd 2.54 x 2.54: TP 0,0
SOT23-6L = smd 0.55 x 1.2: 1 -0.95,-1.3; 2 0,-1.3; 3 0.95,-1.3; 4 0.95,1.3; 5 0,1.3; 6 -0.95,1.3
1X03 = drill 1.016 long: 1 -2.54,0; 2 0,0; 3 2.54,0
85-32004-00X = drill 0.92 pad 1.27: 1 4.71,-1.25; 2 4.71,1.25; 3 2.71,1.25; 4 2.71,-1.25 | drill 2.3 pad 3: M1 0,6.02; M2 0,-6.02
KLBR4 = drill 1 pad 1.3 long: B -2.4,-3.5; S -2.2,3.5 | drill 1 pad 1.2 long: R -4.5,-5.8; T 4.5,-4.5
3.2X2.5MM = smd 1.4 x 1.2: 1 -1.1,-0.85; 2 1.1,-0.85; 3 1.1,0.85; 4 -1.1,0.85

### Placement (x,y rotation side)
C1  81.3,32.5 270 top
C2  28.8,70.93 0 top
C3  34.3,73.4 0 top
C4  36.5,72.8 90 top
C5  82.3,37.3 180 top
C6  72.11,41.45 180 top
C7  33.53,75.6 270 top
C8  38.37,76.66 270 top
C9  86.42,66.11 180 top
C10  97.21,62.3 0 top
C11  98.17,58.49 270 top
C12  98.8,51.83 90 top
C13  87.2,53.1 90 top
C14  50.29,25.21 270 top
C15  47.75,22.99 0 top
C16  94.43,38.85 180 top
C17  33.3,59.7 270 top
C18  94.53,40.55 0 top
C19  38.6,59.8 270 top
C20  45.84,29.02 270 top
C21  42.98,33.79 180 top
C22  29.33,33.47 270 top
C23  27.75,17.28 0 top
C24  43.94,15.69 90 top
C25  50.6,29.02 90 top
C26  23.8,75.3 270 top
C27  41.53,66.86 270 top
C28  37.9,69.4 270 top
C29  37.9,72.8 90 top
C30  50.9,67.9 180 top
C31  51,74.7 180 top
C32  31,62.1 90 top
C33  21.8,65.4 270 top
C34  78.7,29.7 180 top
C35  51.19,56.3 90 top
C36  46.3,57.4 270 top
C37  49.3,59.63 180 top
C38  98.8,66.75 270 top
C39  91.81,68.66 0 top
C40  15.98,68.75 180 top
C41  20.29,7.79 180 top
C42  75.6,29.7 0 top
C45  47.8,68.9 90 top
C46  47.8,73.1 270 top
C47  45.9,68.9 270 top
C48  45.9,73.7 270 top
D1  30.15,75.47 270 top
D2  39.47,66.75 90 top
DISPLAY2  20,37 270 top
I+  not placed on the board
I-  not placed on the board
IC1  77.2,37.9 90 top
IC2  32.8,70.3 0 top
IC3  91.81,63.58 270 top
IC4  50.5,71.3 0 top
IC5  35.9,59.7 0 top
IC6  36.64,24.58 90 top
IC7  91.81,53.1 90 top
IC8  91.82,46.77 90 top
IC9  26.4,63.7 270 top
IC10  77.2,32.1 180 top
J1  19.1,75.5 90 top
L1  50.6,77.6 90 top
L2  47.43,29.02 180 top
L3  27.2,73.3 90 top
L4  50.5,65 90 top
L5  Ferrite  [R0603']  33.3,62.8 270 top
L6  36.71,65.91 180 top
L7  Ferrite  [R0603']  45.9,77.6 0 top
L8  Ferrite  [R0603']  46.8,65 0 top
R1  50  [R0603']  84.1,33.2 270 top
R2  50  [R0603']  82.7,33.2 270 top
R3  100  [R0603']  28.8,69.09 0 top
R4  91k  [R0603']  32.08,75.6 270 top
R5  1M  [R0603']  35.7,75.09 0 top
R6  1M  [R0603']  36.5,69.4 270 top
R7  300  [R0603']  86.42,62.3 180 top
R8  470  [R0603']  86.42,64.21 0 top
R9  3k3  [R0603']  97.85,54.69 0 top
R10  1k  [R0603']  96.89,51.83 270 top
R11  100  [R0603']  101.17,51.32 0 top
R12  1M  [R0603']  100.81,43.49 0 top
R13  1M  [R0603']  105.61,41.49 180 top
R14  10k  [R0603']  81.9,29.7 180 top
R15  10k  [R0603']  81.9,28.1 0 top
R16  10k  [R0603']  105.15,62.12 270 top
R17  10k  [R0603']  105.8,57.2 90 top
R21  22  [R0603']  89.28,13.02 0 top
R22  22  [R0603']  89.28,14.92 0 top
R23  100  [R0603']  86.4,55.5 180 top
R24  100  [R0603']  86.25,49.75 180 top
R25  1k  [R0603']  86.25,48.05 180 top
R26  10k  [R0603']  86.25,46.34 180 top
R27  100k  [R0603']  86.25,44.63 180 top
R28  100  [R0603']  85.7,53.1 270 top
R29  10k  [R0603']  49.02,29.02 270 top
R30  15.94,64.14 0 top
R31  91k  [R0603']  39.3,71.1 90 top
R34  10k  [R0603']  97.85,64.21 0 top
R35  43k  [R0603']  96.89,66.75 270 top
R36  26.41,7.29 0 top
TP1  not placed on the board
TP2  not placed on the board
TP3  not placed on the board
TP4  not placed on the board
TP6  not placed on the board
U1  48.8,56.9 180 top
U+  not placed on the board
U-  not placed on the board
UART  39.43,2.54 180 top
UART1  49.59,2.54 180 top
X1  97.53,14.29 180 top
X3  6.1,73.3 90 top
Y1  47.75,25.21 180 top

### Tracks (layer width: path | path; a pad name or v marks a point on that pad's centre or on a via)
+3V3  (18 unrouted)
+5V  (11 unrouted)
+12V  (8 unrouted)
-12V  (8 unrouted)
ADC_CONVST  (1 unrouted)
ADC_DIN  (1 unrouted)
ADC_DOUT  (1 unrouted)
ADC_SCLK  (1 unrouted)
AINN  (3 unrouted)
AINP  (3 unrouted)
CS_PGA  (1 unrouted)
DAC1  (1 unrouted)
DAC2  (1 unrouted)
EXT4  (2 unrouted)
GND  (56 unrouted)
  pour Route2 (isolate 0.305): 8,80.01 8,0 108.33,0 108.33,80.01
I+  (2 unrouted)
I-  (7 unrouted)
N$1  (2 unrouted)
N$2  (2 unrouted)
N$3  (3 unrouted)
N$4  (2 unrouted)
N$5  (1 unrouted)
N$6  (2 unrouted)
N$7  (1 unrouted)
N$8  (3 unrouted)
N$9  (3 unrouted)
N$10  (2 unrouted)
N$11  (3 unrouted)
N$12  (1 unrouted)
N$14  (3 unrouted)
N$17  (3 unrouted)
N$18  (1 unrouted)
N$20  (2 unrouted)
N$21  (2 unrouted)
N$22  (2 unrouted)
N$25  (1 unrouted)
N$34  (2 unrouted)
N$36  (2 unrouted)
N$37  (2 unrouted)
N$38  (2 unrouted)
N$39  (2 unrouted)
N$42  (2 unrouted)
N$53  (2 unrouted)
N$54  (2 unrouted)
N$55  (1 unrouted)
N$56  (1 unrouted)
N$57  (1 unrouted)
N$58  (1 unrouted)
N$59  (1 unrouted)
N$60  (2 unrouted)
N$61  (1 unrouted)
N$63  (3 unrouted)
N$64  (5 unrouted)
N$65  (3 unrouted)
N$68  (1 unrouted)
N$69  (1 unrouted)
N$70  (3 unrouted)
N$71  (5 unrouted)
N$73  (1 unrouted)
N$74  (4 unrouted)
N$75  (2 unrouted)
N$76  (3 unrouted)
N$77  (1 unrouted)
N$78  (2 unrouted)
N$79  (1 unrouted)
N$80  (1 unrouted)
N$81  (1 unrouted)
REF  (5 unrouted)
RX  (1 unrouted)
SCLK  (1 unrouted)
SDI  (1 unrouted)
SDO  (1 unrouted)
SOUND  (1 unrouted)
SPLITSUPPLY_EN  (3 unrouted)
SPLITSUPPLY_PSE  (1 unrouted)
SWCLK  (1 unrouted)
SWDIO  (1 unrouted)
TX  (1 unrouted)
U+  (2 unrouted)
U-  (2 unrouted)
USB_N  (1 unrouted)
USB_P  (1 unrouted)
V+  (8 unrouted)
VON  (1 unrouted)
VOP  (1 unrouted)